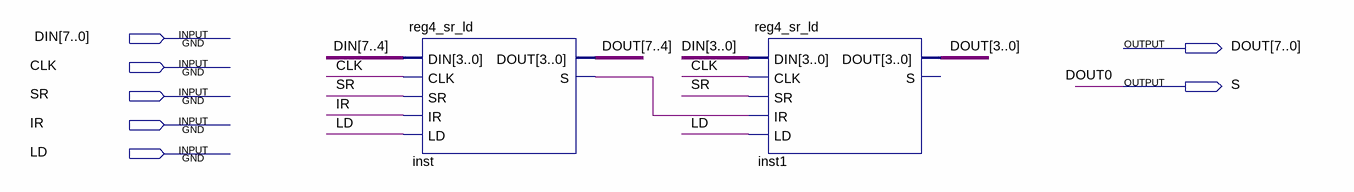
[diagram p0: schematic sheet]
// Quartus schematic reg8_sr_ld.bdf as structural Verilog: 2 symbols, 7 pins
module reg8_sr_ld (
  input  [7:0] DIN,
  input  CLK,
  input  SR,
  input  IR,
  input  LD,
  output [7:0] DOUT,
  output S
);

  wire inst_s;

  reg4_sr_ld inst (.DIN(DIN[7:4]), .CLK(CLK), .SR(SR), .IR(IR), .LD(LD), .DOUT(DOUT[7:4]), .S(inst_s));
  reg4_sr_ld inst1 (.DIN(DIN[3:0]), .CLK(CLK), .SR(SR), .IR(inst_s), .LD(LD), .DOUT(DOUT[3:0]));  // open: S

  assign S = DOUT[0];
endmodule
